# EAGLE design DP_pwer_controler_v1 (EAGLE 8.7.0)
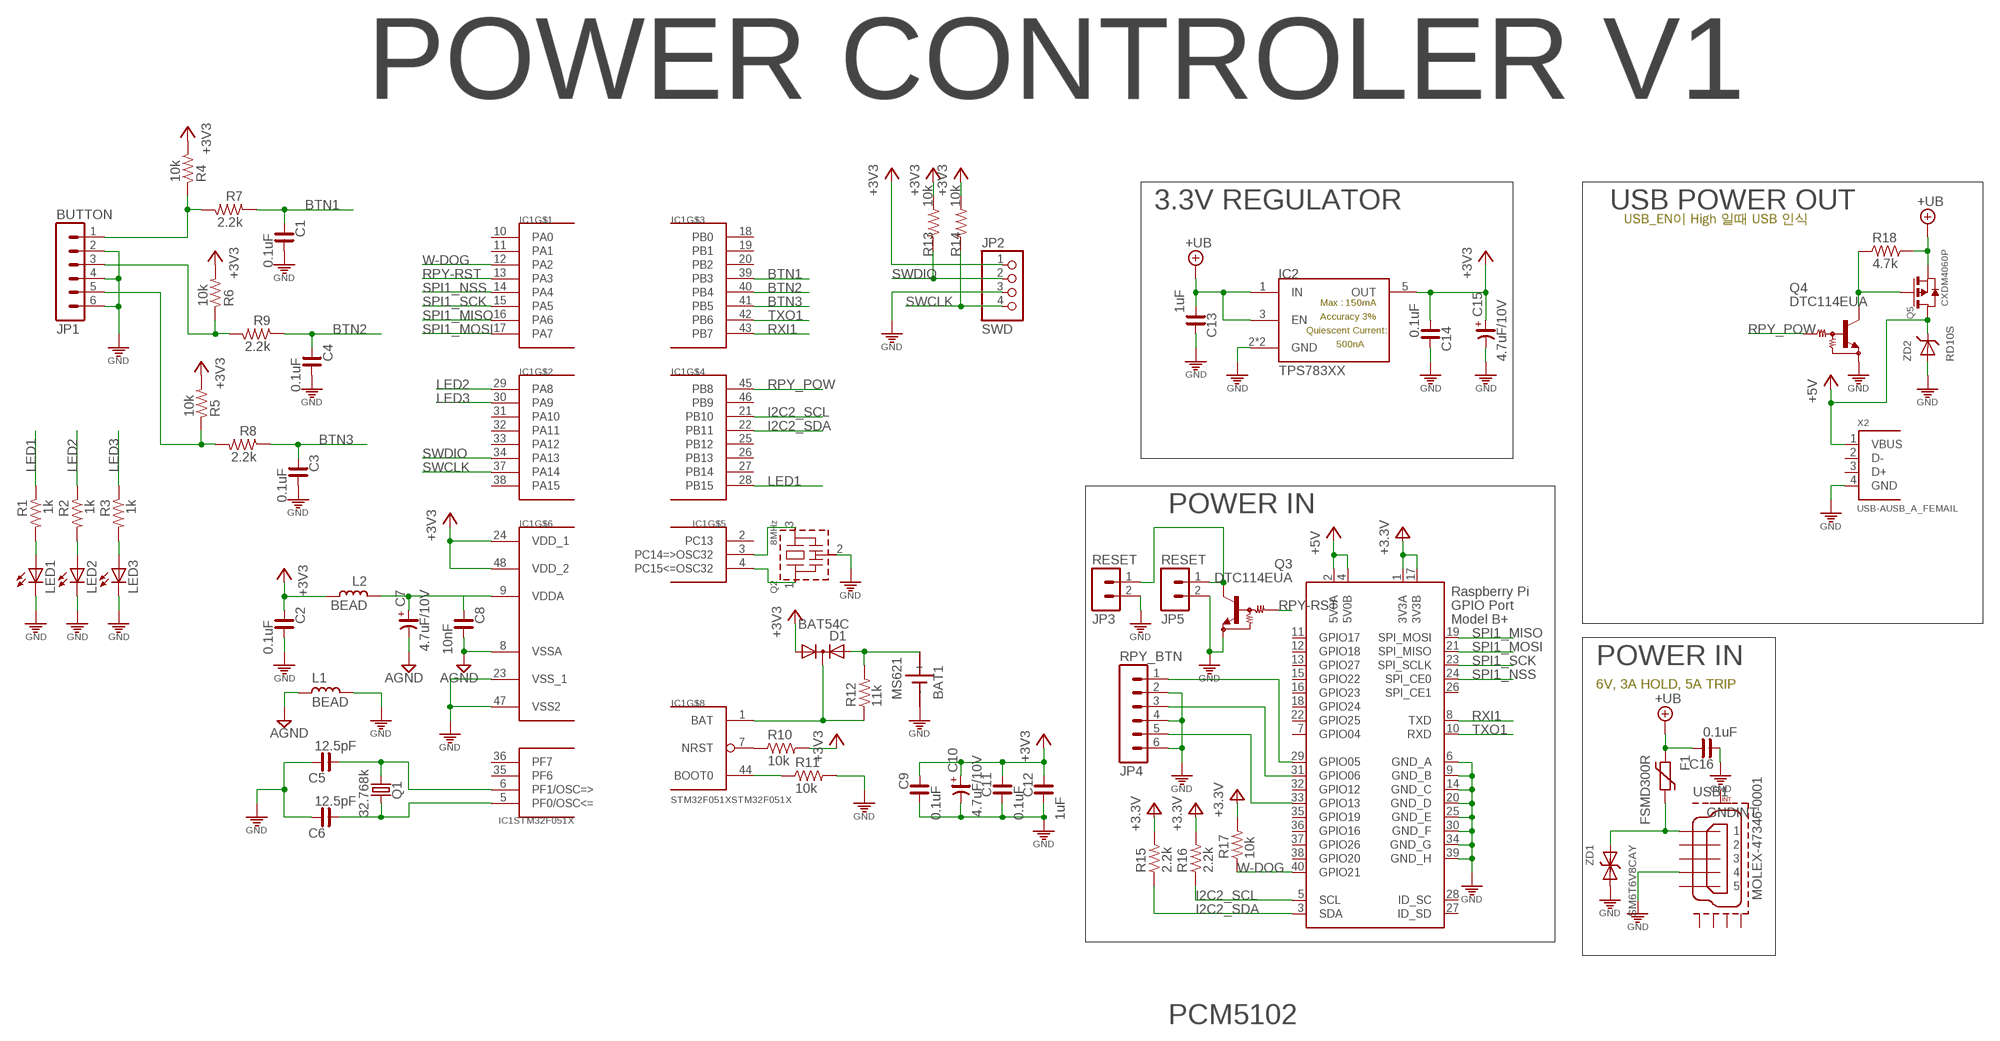
[diagram p0: schematic, sheet 1]

## Parts
BAT1  MS621  MS614  [MS621]
C1  0.1uF  C_0603  [C0603]
C2  0.1uF  C_0603  [C0603]
C3  0.1uF  C_0603  [C0603]
C4  0.1uF  C_0603  [C0603]
C5  12.5pF  C_0603  [C0603]
C6  12.5pF  C_0603  [C0603]
C7  4.7uF/10V  CP_2012  [C2012/T]
C8  10nF  C_0603  [C0603]
C9  0.1uF  C_0603  [C0603]
C10  4.7uF/10V  CP_2012  [C2012/T]
C11  0.1uF  C_0603  [C0603]
C12  1uF  C_0603  [C0603]
C13  1uF  C_0603  [C0603]
C14  0.1uF  C_0603  [C0603]
C15  4.7uF/10V  CP_2012  [C2012/T]
C16  0.1uF  C_0603  [C0603]
D1  BAT54C  [SOT23]
F1  FSMD300R  1812L  [1812L]
IC1  STM32F051XSTM32F051X  [TQFP48]
IC2  TPS783XX  [SOT23-5L]
JP1  BUTTON  MA06-1SMALL  [MA06-1-S]
JP2  SWD  PINHD-1X4M  [1X04M]
JP3  RESET  MA02SMD  [MA02-1-MOL]
JP4  RPY_BTN  MA06-1SMALL  [MA06-1-S]
JP5  RESET  MA02SMD  [MA02-1-MOL]
L1  BEAD  L_0603  [L0603]
L2  BEAD  L_0603  [L0603]
LED1  LEDSMD-1608  [LED-1608]
LED2  LEDSMD-1608  [LED-1608]
LED3  LEDSMD-1608  [LED-1608]
Q1  32.768k  MC-306  [MC-306]
Q2  8MHz  X-TAL-SMALLCSTCE16M00V53  [CSTLA_X]
Q3  DTC114EUA  [SC59-BEC]
Q4  DTC114EUA  [SC59-BEC]
Q5  CXDM4060P  CXDM4060PCXDM4060P  [SOT89]
R1  1k  R_0603  [R0603]
R2  1k  R_0603  [R0603]
R3  1k  R_0603  [R0603]
R4  10k  R_0603  [R0603]
R5  10k  R_0603  [R0603]
R6  10k  R_0603  [R0603]
R7  2.2k  R_0603  [R0603]
R8  2.2k  R_0603  [R0603]
R9  2.2k  R_0603  [R0603]
R10  10k  R_0603  [R0603]
R11  10k  R_0603  [R0603]
R12  11k  R_0603  [R0603]
R13  10k  R_0603  [R0603]
R14  10k  R_0603  [R0603]
R15  2.2k  R_0603  [R0603]
R16  2.2k  R_0603  [R0603]
R17  10k  R_0603  [R0603]
R18  4.7k  R_0603  [R0603]
USB1  MOLEX-47346-0001  [MOLEX-47364-0001]
X1  RASPI_BOARD_B+#_F  [RASPI_BOARD_B+_FULL]
X2  USB-AUSB_A_FEMAIL  [USB_A_FEMAIL]
ZD1  SM6T6V8CAY  ZDSM6T33CAY  [SMB]
ZD2  RD10S  ZENER_DIODERD47S  [DSMM]

## Nets
3V3: R15.2 R16.2 R17.2 X1.1(3V3A) X1.17(3V3B) ; supply symbol labelled +3V3
+3V3: C2.1 C9.1 C10.+ C11.1 C12.1 C14.2 C15.+ D1.G IC1.24(VDD_1) IC1.48(VDD_2) IC2.5(OUT) JP2.1 L2.1 R4.2 R5.2 R6.2 R10.2 R13.2 R14.2
+5V: Q5.2(D) Q5.2@1(D) X1.2(5V0A) X1.4(5V0B) X2.1(VBUS) ZD2.C
+UB: C13.2 C16.1 F1.P$1 IC2.1(IN) IC2.3(EN) Q5.1(S) R18.2
AGND: C7.- C8.2 IC1.8(VSSA) L1.2
BTN1: C1.1 IC1.39(PB3) R7.1
BTN2: C4.1 IC1.40(PB4) R9.1
BTN3: C3.1 IC1.41(PB5) R8.1
GND [GND]: BAT1.- C1.2 C2.2 C3.2 C4.2 C5.1 C6.1 C9.2 C10.- C11.2 C12.2 C13.1 C14.1 C15.- C16.2 IC1.23(VSS_1) IC1.47(VSS2) IC2.2(GND) IC2.4(GND) JP1.2 JP1.4 JP1.6 JP2.3 JP3.2 JP4.2 JP4.4 JP4.6 JP5.2 L1.1 LED1.C LED2.C LED3.C Q2.2(GND) Q3.1(GND) Q4.1(GND) R11.2 USB1.4 X1.6(GND_A) X1.9(GND_B) X1.14(GND_C) X1.20(GND_D) X1.25(GND_E) X1.30(GND_F) X1.34(GND_G) X1.39(GND_H) X2.4(GND) ZD1.C(K) ZD2.A
I2C2_SCL: IC1.21(PB10) R16.1 X1.5(SCL)
I2C2_SDA: IC1.22(PB11) R15.1 X1.3(SDA)
LED1: IC1.28(PB15) R1.1
LED2: IC1.29(PA8) R2.1
LED3: IC1.30(PA9) R3.1
N$1: JP1.5 R5.1 R8.2
N$2: F1.P$2 USB1.1 ZD1.A
N$3: IC1.7(NRST) R10.1
N$4: JP3.1 JP5.1 Q3.3(OUT)
N$7: JP4.1 X1.29(GPIO05)
N$8: C7.+ C8.1 IC1.9(VDDA) L2.2
N$9: BAT1.+ D1.S R12.2
N$11: JP1.3 R6.1 R9.2
N$12: JP4.3 X1.31(GPIO06)
N$13: IC1.3(PC14=>OSC32) Q2.3(OUT)
N$14: JP4.5 X1.33(GPIO13)
N$16: IC1.44(BOOT0) R11.1
N$17: LED1.A R1.2
N$18: LED2.A R2.2
N$19: LED3.A R3.2
N$20: JP1.1 R4.1 R7.2
N$32: Q4.3(OUT) Q5.3(G) R18.1
N$33: D1.D IC1.1(BAT) R12.1
N$38: IC1.4(PC15<=OSC32) Q2.1(IN)
N$95: C6.2 IC1.5(STM32F051X:PF0/OSC<=) Q1.1
N$96: C5.2 IC1.6(STM32F051X:PF1/OSC=>) Q1.4
RPY-RST: IC1.13(PA3) Q3.2(IN)
RPY_POW: IC1.45(PB8) Q4.2(IN)
RXI1: IC1.43(PB7) X1.8(TXD)
SPI1_MISO: IC1.16(PA6) X1.19(SPI_MOSI)
SPI1_MOSI: IC1.17(PA7) X1.21(SPI_MISO)
SPI1_NSS: IC1.14(PA4) X1.24(SPI_CE0)
SPI1_SCK: IC1.15(PA5) X1.23(SPI_SCLK)
SWCLK: IC1.37(PA14) JP2.4 R14.1
SWDIO: IC1.34(PA13) JP2.2 R13.1
TXO1: IC1.42(PB6) X1.10(RXD)
W-DOG: IC1.12(PA2) R17.1 X1.40(GPIO21)
Unconnected: IC1.2(PC13) IC1.10(PA0) IC1.11(PA1) IC1.18(PB0) IC1.19(PB1) IC1.20(PB2) IC1.25(PB12) IC1.26(PB13) IC1.27(PB14) IC1.31(PA10) IC1.32(PA11) IC1.33(PA12) IC1.35(STM32F051X:PF6) IC1.36(STM32F051X:PF7) IC1.38(PA15) IC1.46(PB9) USB1.2 USB1.3 USB1.5 USB1.GND1 USB1.GND2 USB1.GND3 USB1.GND4 X1.7(GPIO04) X1.11(GPIO17) X1.12(GPIO18) X1.13(GPIO27) X1.15(GPIO22) X1.16(GPIO23) X1.18(GPIO24) X1.22(GPIO25) X1.26(SPI_CE1) X1.27(ID_SD) X1.28(ID_SC) X1.32(GPIO12) X1.35(GPIO19) X1.36(GPIO16) X1.37(GPIO26) X1.38(GPIO20) X2.2(D-) X2.3(D+)

## Notes on the sheet
- https://webench.ti.com/webench5/power/webench5.cgi?app=filterarchitect&origin=ti_panel&filterType=Lowpass
- POWER CONTROLER V1
- 3.3V REGULATOR | USB POWER OUT
- USB_EN이 High 일때 USB 인식
- POWER IN
- POWER IN
- 6V, 3A HOLD, 5A TRIP
- PCM5102

## Library data of the parts
BAT1 = cona_lib:MS614: SII Micro Battery
C1-C6 C8 C9 C11-C14 C16 = cona_lib:C_: NON-POLARIZED CAP
C7 C10 C15 = cona_lib:CP_: POLARIZED CAP
D1 = cona_lib:BAT54C
F1 = ptc-littlefuse:1812L
IC1 = stm32:STM32F051X
IC2 = cona_lib:TPS783XX
JP1 JP4 = cona_lib:MA06-1: PIN HEADER
JP2 = pinhead:PINHD-1X4: PIN HEADER
JP3 JP5 = cona_lib:MA02
L1 L2 = cona_lib:L_: INDUCTOR
LED1-LED3 = cona_lib:LED: LED OSRAM: - CHIPLED LG R971, LG N971, LY N971, LG Q971, LY Q971, LO R971, LY R971 LH N974, LH R974 LS Q976, LO Q976, LY Q976 LO Q996 - Hyper CHIPLED LW Q18S LB Q993, LB Q99A, LB R99A - SideLED LS A670, LO A670, LY A670, LG A670, LP A670 LB A673, LV A673, LT A673, LW A673 LH A674 LY A675 LS A676, LA A676, LO A676, LY A676, LW A676 LS A679, LY A679, LG A679 - Hyper Micro SIDELED® LS Y876, LA Y876, LO Y876, LY Y876 LT Y87S - SmartLED LW L88C, LW L88S LB L89C, LB L89S, LG L890 LS L89K, LO L89K, LY L89K LS L896, LA L896, LO L896, LY L896 - TOPLED LS T670, LO T670, LY T670, LG T670, LP T670 LSG T670, LSP T670, LSY T670, LOP T670, LYG T670 LG T671, LOG T671, LSG T671 LB T673, LV T673, LT T673, LW T673 LH T674 LS T676, LA T676, LO T676, LY T676, LB T676, LH T676, LSB T676, LW T676 LB T67C, LV T67C, LT T67C, LS T67K, LO T67K, LY T67K, LW E67C LS E67B, LA E67B, LO E67B, LY E67B, LB E67C, LV E67C, LT E67C LW T67C LS T679, LY T679, LG T679 LS T770, LO T770, LY T770, LG T770, LP T770 LB T773, LV T773, LT T773, LW T773 LH T774 LS E675, LA E675, LY E675, LS T675 LS T776, LA T776, LO T776, LY T776, LB T776 LHGB T686 LT T68C, LB T68C - Hyper Mini TOPLED® LB M676 - Mini TOPLED Santana® LG M470 LS M47K, LO M47K, LY M47K Source: http://www.osram.convergy.de LUXEON: - LUMILED® LXK2-PW12-R00, LXK2-PW12-S00, LXK2-PW14-U00, LXK2-PW14-V00 LXK2-PM12-R00, LXK2-PM12-S00, LXK2-PM14-U00 LXK2-PE12-Q00, LXK2-PE12-R00, LXK2-PE12-S00, LXK2-PE14-T00, LXK2-PE14-U00 LXK2-PB12-K00, LXK2-PB12-L00, LXK2-PB12-M00, LXK2-PB14-N00, LXK2-PB14-P00, LXK2-PB14-Q00 LXK2-PR12-L00, LXK2-PR12-M00, LXK2-PR14-Q00, LXK2-PR14-R00 LXK2-PD12-Q00, LXK2-PD12-R00, LXK2-PD12-S00 LXK2-PH12-R00, LXK2-PH12-S00 LXK2-PL12-P00, LXK2-PL12-Q00, LXK2-PL12-R00 Source: www.luxeon.com KINGBRIGHT: KA-3528ASYC Source: www.kingbright.com
Q1 = crystal:MC-306: kHz RANGE CRYSTAL UNIT SMD Source: MC-306_405_406_E07X.PDF Homepage <http://www.epsontoyocom.co.jp>; MPN: MC-306 60.0KHZ 100PPM ,12.5PF; OC_FARNELL: 1278040; OC_NEWARK: 31M5576
Q2 = cona_lib:X-TAL-SMALL: Ceramic Resonators MuRata CSTCE08MOOG52A
Q3 Q4 = cona_lib:DTC114EUA: NPN Bias Resistor Transistor
Q5 = cona_lib:CXDM4060P
R1-R18 = cona_lib:R_: RESISTOR
USB1 = usb_con-update:MOLEX-47346-0001: MICRO USB B, BOTTOM MOUNT
X1 = raspberrypi_bastelstube_v13:RASPI_BOARD_B+#: Raspberry Pi GPIO connector with markings for the outer dimensions of the Raspberry Pi board model B+ with different sets of drill holes or mounting pads All pins connected
X2 = cona_lib:USB-A: USB A NTOM20014
ZD1 = GRU-EURO6:ZD
ZD2 = GRU-EURO6:ZENER_DIODE

## Net classes
0 default: clearance 0.152 mm
1 power: width 0.152 mm
2 GND: width 0.152 mm, clearance 0.152 mm

## Board
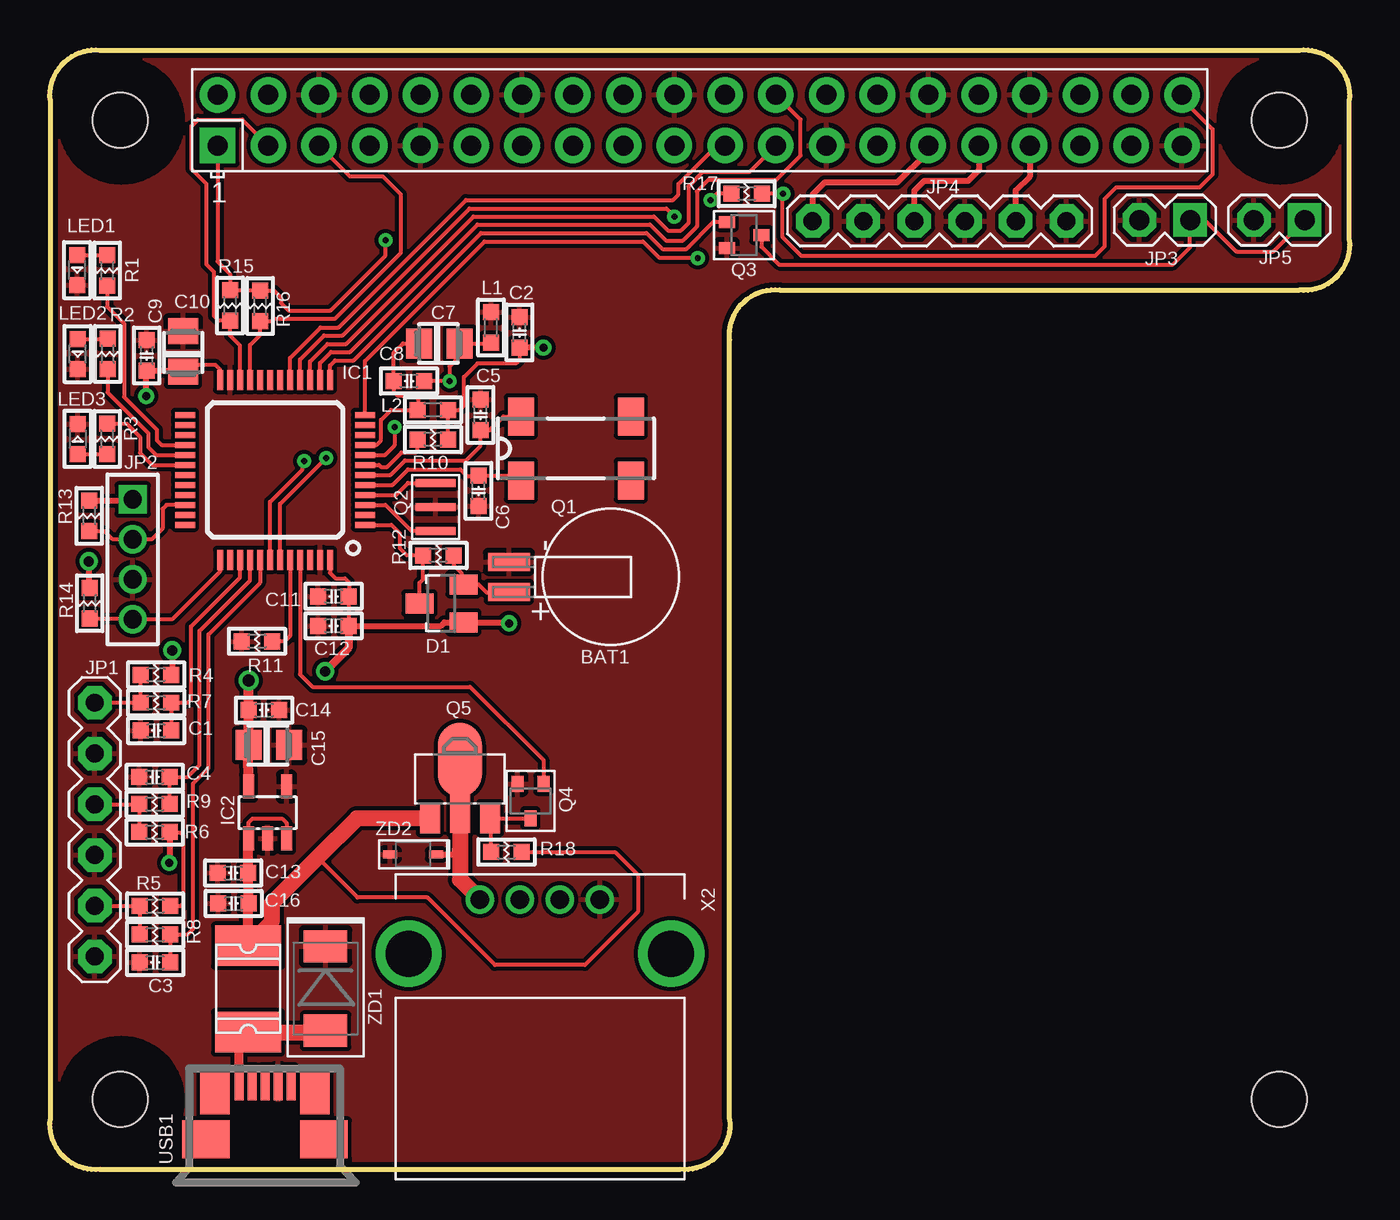
[diagram p1: board, top side]
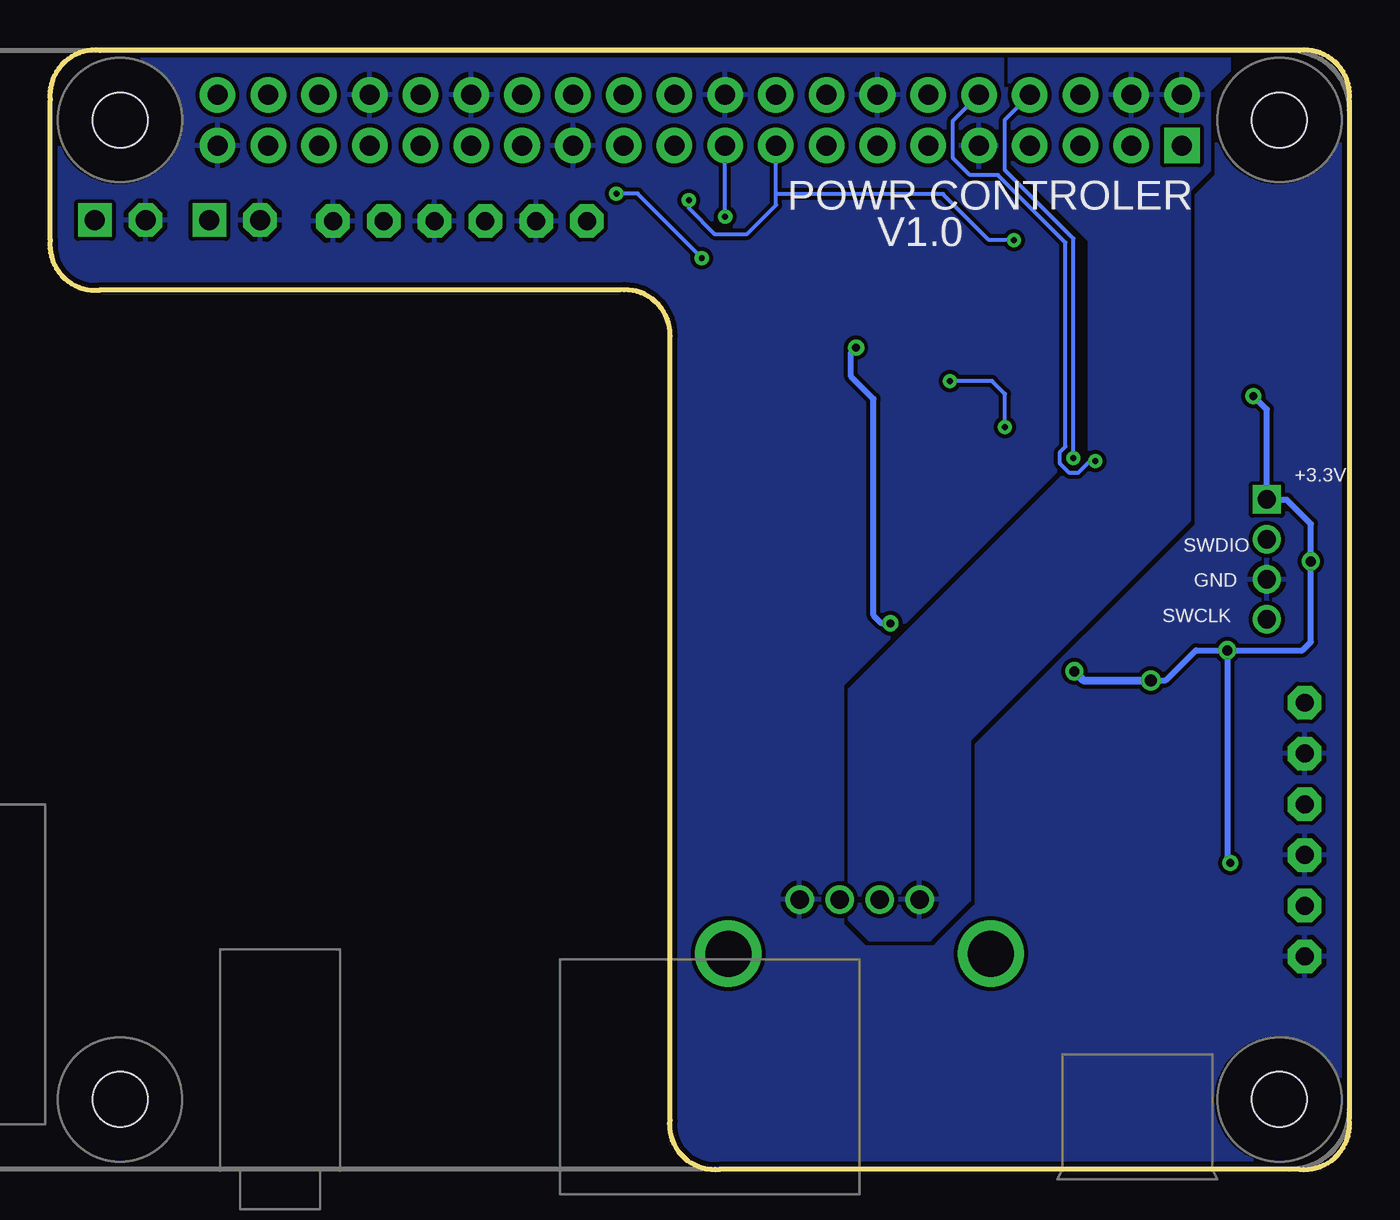
[diagram p2: board, bottom side, seen from below]

Size 65.03 x 56.03 mm. Coordinates in mm from the lower left corner, seen from the top.
Outline: 0.01,53.51 0.01,2.51 arc103 2.51,0.01 31.51,0.01 arc103 34.01,2.51 34.01,41.51 arc-103 36.51,44.01 62.51,44.01 arc103 65.01,46.51 65.01,53.51 arc103 62.51,56.01 2.51,56.01 arc103 0.01,53.51
Copper layers (1*16): Top 0.035mm / dielectric 1.5mm / Bottom 0.035mm
Design rules "KHC_mm": minimum track width 0.2mm, minimum drill 0.3mm, track to track 0.2mm, track to pad 0.2mm, pad to pad 0.2mm, via to via 0.2mm, smd to smd 0.2mm, copper to edge 10mil, drill to drill 0.2mm, minimum pad ring 10mil, minimum via ring 8mil, stop-mask expansion 4mil, vias tented up to drill 0mil, thermal gap 10mil

### Footprints (pad centres in the part's own frame; a part is rotated, then mirrored left to right if it is on the bottom)
MS621 = smd 2.1 x 0.9: + 5.1,0.75; - 5.1,-0.75
C0603 = smd 0.8 x 0.8: 1 -0.762,0; 2 0.762,0
C2012/T = smd 1.3 x 1.5: + 1.016,0; - -1.016,0
SOT23 = smd 1 x 1.4: D 0,-1.1; G 0.95,1.1; S -0.95,1.1
1812L = smd 2.03 x 3.3: P$1 -2.16,0; P$2 2.16,0
TQFP48 = smd 0.3 x 1: 1 -2.75,-4.5; 2 -2.25,-4.5; 3 -1.75,-4.5; 4 -1.25,-4.5; 5 -0.75,-4.5; 6 -0.25,-4.5; 7 0.25,-4.5; 8 0.75,-4.5; 9 1.25,-4.5; 10 1.75,-4.5; 11 2.25,-4.5; 12 2.75,-4.5; 25 2.75,4.5; 26 2.25,4.5; 27 1.75,4.5; 28 1.25,4.5; 29 0.75,4.5; 30 0.25,4.5; 31 -0.25,4.5; 32 -0.75,4.5; 33 -1.25,4.5; 34 -1.75,4.5; 35 -2.25,4.5; 36 -2.75,4.5 | smd 1 x 0.3: 13 4.5,-2.75; 14 4.5,-2.25; 15 4.5,-1.75; 16 4.5,-1.25; 17 4.5,-0.75; 18 4.5,-0.25; 19 4.5,0.25; 20 4.5,0.75; 21 4.5,1.25; 22 4.5,1.75; 23 4.5,2.25; 24 4.5,2.75; 37 -4.5,2.75; 38 -4.5,2.25; 39 -4.5,1.75; 40 -4.5,1.25; 41 -4.5,0.75; 42 -4.5,0.25; 43 -4.5,-0.25; 44 -4.5,-0.75; 45 -4.5,-1.25; 46 -4.5,-1.75; 47 -4.5,-2.25; 48 -4.5,-2.75
SOT23-5L = smd 0.55 x 1.2: 1 -0.95,-1.3; 2 0,-1.3; 3 0.95,-1.3; 4 0.95,1.3; 5 -0.95,1.3
MA06-1-S = drill 0.9 pad 1.676 octagon: 1 -6.35,-1.27; 2 -3.81,-1.27; 3 -1.27,-1.27; 4 1.27,-1.27; 5 3.81,-1.27; 6 6.35,-1.27
1X04M = drill 0.914 square: 1 -3,0 | drill 0.914: 2 -1,0; 3 1,0; 4 3,0
MA02-1-MOL = drill 1 pad 1.676 square: 1 -1.27,0 | drill 1 pad 1.676 octagon: 2 1.27,0
L0603 = smd 0.8 x 0.8: 1 -0.762,0; 2 0.762,0
LED-1608 = smd 0.8 x 0.8: A -0.75,0; C 0.75,0
MC-306 = smd 1.3 x 1.9: 1 -2.75,-1.6; 2 2.75,-1.6; 3 2.75,1.6; 4 -2.75,1.6
CSTLA_X = smd 0.4 x 2: 1 -1.2,0; 2 0,0; 3 1.2,0
SC59-BEC = smd 0.6 x 0.8: 1 0.65,-0.863; 2 -0.65,-0.863; 3 0,0.863
SOT89 = smd 1 x 1.5: 1 -1.499,-1.981; 3 1.499,-1.981 | smd 1 x 2: 2 0,-1.727 | smd 2.2 x 3.7: 2@1 0,0.94
R0603 = smd 0.8 x 0.8: 1 -0.762,0; 2 0.762,0
MOLEX-47364-0001 = smd 1.7 x 0.45: 1 2.8,1.3; 2 2.8,0.65; 3 2.8,0; 4 2.8,-0.65; 5 2.8,-1.3 | smd 1.9 x 2.375: GND1 0,2.95; GND4 0,-2.95 | smd 2.1 x 1.475: GND2 2.3,2.5; GND3 2.3,-2.5
RASPI_BOARD_B+_FULL = drill 1 pad 1.778 square: 1 8.37,51.23 | drill 1 pad 1.778: 2 8.37,53.77; 3 10.91,51.23; 4 10.91,53.77; 5 13.45,51.23; 6 13.45,53.77; 7 15.99,51.23; 8 15.99,53.77; 9 18.53,51.23; 10 18.53,53.77; 11 21.07,51.23; 12 21.07,53.77; 13 23.61,51.23; 14 23.61,53.77; 15 26.15,51.23; 16 26.15,53.77; 17 28.69,51.23; 18 28.69,53.77; 19 31.23,51.23; 20 31.23,53.77; 21 33.77,51.23; 22 33.77,53.77; 23 36.31,51.23; 24 36.31,53.77; 25 38.85,51.23; 26 38.85,53.77; 27 41.39,51.23; 28 41.39,53.77; 29 43.93,51.23; 30 43.93,53.77; 31 46.47,51.23; 32 46.47,53.77; 33 49.01,51.23; 34 49.01,53.77; 35 51.55,51.23; 36 51.55,53.77; 37 54.09,51.23; 38 54.09,53.77; 39 56.63,51.23; 40 56.63,53.77 | hole 2.75: 3.5,3.5; 3.5,52.5; 61.5,3.5; 61.5,52.5
USB_A_FEMAIL = drill 0.92: 1 3,0; 2 1,0; 3 -1,0; 4 -3,0 | drill 2.3: SHILD -6.57,2.71; SHILD@2 6.57,2.71
SMB = smd 1.62 x 2.18: A 2.11,0; C -2.11,0
DSMM = smd 0.7 x 0.4: A 1.15,0; C -1.15,0

### Placement (x,y rotation side)
BAT1  28.06,29.66 180 top
C1  5.31,21.96 180 top
C2  23.49,41.89 90 top
C3  5.26,10.36 180 top
C4  5.24,19.64 180 top
C5  21.54,37.76 270 top
C6  21.44,33.96 90 top
C7  19.49,41.34 180 top
C8  17.96,39.46 0 top
C9  4.84,40.74 90 top
C10  6.66,40.94 270 top
C11  14.19,28.69 180 top
C12  14.19,27.21 180 top
C13  9.16,14.84 0 top
C14  10.71,22.99 180 top
C15  10.96,21.24 180 top
C16  9.19,13.31 180 top
D1  19.59,28.34 270 top
F1  9.91,9.04 270 top
IC1  11.26,35.01 90 top
IC2  10.89,17.86 0 top
JP1  3.51,17.01 270 top
JP2  4.14,30.54 270 top
JP3  55.79,47.51 180 top
JP4  44.51,48.74 0 top
JP5  61.51,47.51 180 top
L1  22.06,42.14 270 top
L2  19.16,38.01 180 top
LED1  1.36,45.01 270 top
LED2  1.39,40.81 270 top
LED3  1.39,36.56 90 top
Q1  26.31,36.09 0 top
Q2  19.29,33.16 270 top
Q3  34.74,46.76 270 top
Q4  24.04,18.44 180 top
Q5  20.51,19.56 0 top
R1  2.86,44.99 90 top
R2  2.89,40.81 90 top
R3  2.86,36.56 270 top
R4  5.31,24.76 0 top
R5  5.26,13.19 0 top
R6  5.24,16.89 0 top
R7  5.31,23.36 180 top
R8  5.26,11.76 180 top
R9  5.24,18.29 180 top
R10  19.16,36.54 0 top
R11  10.36,26.44 180 top
R12  19.44,30.74 0 top
R13  1.96,32.71 90 top
R14  1.99,28.34 90 top
R15  9.01,43.24 90 top
R16  10.51,43.21 90 top
R17  34.86,48.84 180 top
R18  22.84,15.89 0 top
USB1  10.76,1.51 90 top
X1  0.01,0.01 0 top
X2  24.51,13.51 180 top
ZD1  13.79,9.06 270 top
ZD2  18.16,15.76 180 top

### Tracks (layer width: path | path; a pad name or v marks a point on that pad's centre or on a via)
3V3  (via drill 0.3)
  Top 0.2: X1.1 8.38,45.44 9.01,44.81 R15.2 10.49,44 R16.2 11.23,43.98 11.56,43.64 11.56,43.36 11.94,42.99 14.04,42.99 16.79,45.74 v16.79,46.51 | R17.2 33.39,48.84 v33.06,48.51
  Bottom 0.2: v33.06,48.51 33.06,48.11 31.76,46.81 30.14,46.81 28.69,48.26 28.69,48.76 | 28.69,48.76 28.69,51.23 X1.17 | v16.79,46.51 18.04,46.51 20.34,48.81 28.64,48.81 28.69,48.76
+3V3  (via drill 0.4, 0.5, 0.6)
  Top 0.2: R5.2 6.54,13.19 6.69,13.34 6.69,16.71 6.56,16.84 6.05,16.84 R6.2 | R10.2 L2.1 20.49,38.01 20.71,38.24 20.71,39.66 21.39,40.34 23.31,40.34 23.49,40.51 C2.1 | IC1.48 14.01,29.86 14.29,29.59 14.76,29.59 14.96,29.39 C11.1 C12.1 | IC1.24 8.51,40.04 8.29,40.26 7,40.26 C10.+
  Top 0.3: v6.11,25.99 6.11,24.8 R4.2 | v1.94,30.44 1.94,29.15 R14.2 | R13.2 4.08,33.48 JP2.1 | R6.2 5.99,16.88 5.99,15.36 v5.96,15.34 | v4.81,38.71 4.81,39.95 C9.1 6.61,39.98 C10.+ | 14.94,27.2 C12.1 19.56,27.21 19.74,27.39 D1.G 22.91,27.39 v22.96,27.34 | v24.69,41.14 23.58,41.14 C2.1
  Top 0.4: 14.94,27.2 14.94,26.11 v13.76,24.94
  Top 0.5: IC2.5 9.91,21 C15.+ 9.95,22.88 C14.2 v9.95,24.48
  Bottom 0.3: v6.11,25.99 7.69,25.99 9.2,24.48 v9.95,24.48 | v6.11,25.99 2.36,25.99 1.94,26.41 v1.94,30.44 1.94,32.31 3.14,33.51 4.11,33.51 JP2.1 4.14,38.04 v4.81,38.71 | v6.11,25.99 6.11,15.46 v5.96,15.34 | v22.96,27.34 23.41,27.34 23.81,27.74 23.81,38.56 24.94,39.69 24.94,40.89 v24.69,41.14
  Bottom 0.4: v13.76,24.94 13.31,24.49 9.96,24.49 v9.95,24.48
+5V
  Top 0.3: ZD2.C 20.26,15.76 20.51,16.01 | Q5.2 Q5.2@1
  Top 0.8: Q5.2 20.51,16.01 20.51,14.51 X2.1
  pour Bottom: 6.01,56.01 17.01,56.01 17.01,50.51 13.01,46.51 13.01,36.01 25.01,24.01 25.01,12.51 24.01,11.51 21.01,11.51 19.01,13.51 19.01,21.51 8.01,32.51 8.01,49.01 7.01,50.01 7.01,54.01 6.01,55.01
+UB
  Top 0.2: R18.2 28.26,15.89 29.41,14.74 29.41,12.89 26.76,10.24 22.26,10.24 18.89,13.61 15.39,13.61 13.46,15.54 13.46,15.56 13.4,15.63 | IC2.1 9.94,17.36 10.14,17.56 11.61,17.56 11.84,17.34 IC2.3
  Top 0.5: F1.P$1 9.91,13.38 C16.1 C13.2 9.93,16.3 IC2.1
  Top 0.8: Q5.1 15.36,17.58 13.4,15.63 11.09,13.31 11.09,12.37 F1.P$1
AGND  (via drill 0.3)
  Top 0.2: L1.2 21.88,41.34 C7.- 20.5,40.7 19.99,40.19 v19.99,39.46 C8.2 | IC1.8 16.76,35.76 17.24,36.24 v17.24,37.16
  Bottom 0.2: v19.99,39.46 17.89,39.46 17.24,38.81 v17.24,37.16
BTN1
  Top 0.2: IC1.39 9.51,29.64 7.06,27.19 7.06,23.54 6.89,23.36 R7.1 C1.1
BTN2
  Top 0.2: R9.1 C4.1 6.89,19.64 7.49,20.24 7.49,26.96 10.01,29.49 IC1.40
BTN3
  Top 0.2: C3.1 R8.1 6.89,11.76 7.16,12.04 7.16,19.31 7.94,20.09 7.94,26.79 10.51,29.36 IC1.41
GND
  pour Top (rank 4): 0.01,0.01 0.01,56.01 76.01,56.01 76.01,0.01
  pour Bottom (rank 4): 0.01,0.01 0.01,56.01 76.01,56.01 76.01,0.01
I2C2_SCL
  Top 0.2: IC1.21 10.01,41.26 10.51,41.76 R16.1 10.53,42.44 11.09,42.44 11.21,42.56 14.24,42.56 17.56,45.89 17.56,48.79 16.66,49.69 15.02,49.69 X1.5
I2C2_SDA
  Top 0.2: IC1.22 9.51,41.24 9.01,41.74 R15.1 8.45,42.48 8.21,42.71 8.21,44.91 7.84,45.29 7.84,49.31 7.09,50.06 7.09,52.21 7.41,52.54 9.63,52.54 X1.3
LED1
  Top 0.2: IC1.28 5.59,36.26 5.36,36.49 5.36,37.01 3.71,38.66 3.71,42.34 2.86,43.19 R1.1
LED2
  Top 0.2: IC1.29 5.31,35.76 4.94,36.14 4.94,36.84 2.89,38.89 R2.1
LED3
  Top 0.2: IC1.30 5.11,35.26 4.51,35.86 4.51,36.66 3.85,37.33 R3.1
N$1
  Top 0.2: JP1.5 4.49,13.2 R5.1 R8.2
N$2
  Top 0.45: USB1.1 9.46,6.43 F1.P$2
  Top 0.8: F1.P$2 13.71,6.88 ZD1.A
N$3
  Top 0.2: IC1.7 16.46,35.26 16.56,35.16 16.86,35.16 17.59,35.89 18.31,35.89 18.39,35.96 18.39,36.53 R10.1
N$4
  Top 0.2: JP5.1 61.21,45.94 59.36,45.94 57.79,47.51 JP3.1 57.04,47.49 57.04,46.14 56.19,45.29 36.49,45.29 35.6,46.18 Q3.3
N$5
  cutout Top: 3.56,6.49 arc90 0.56,3.49 arc90 3.56,0.49 arc90 6.56,3.49 arc90
  cutout Bottom: 3.56,6.49 arc90 0.56,3.49 arc90 3.56,0.49 arc90 6.56,3.49 arc90
N$6
  cutout Top: 3.56,55.49 arc90 0.56,52.49 arc90 3.56,49.49 arc90 6.56,52.49 arc90
  cutout Bottom: 3.56,55.49 arc90 0.56,52.49 arc90 3.56,49.49 arc90 6.56,52.49 arc90
N$7
  Top 0.3: X1.29 43.94,50.94 42.39,49.39 38.76,49.39 38.16,48.79 JP4.1
N$8
  Top 0.2: IC1.9 16.34,36.26 16.56,36.49 16.56,37.51 17.06,38.01 L2.2 18.41,38.03 18.41,38.56 18.24,38.74 17.39,38.74 17.2,38.93 C8.1 17.2,40.88 17.66,41.34 C7.+
N$9
  Top 0.2: R12.2 20.2,30.25 20.59,29.86 20.59,29.39 D1.S 21.44,29.29 21.84,28.89 23.34,28.89 23.49,29.04 23.09,29.04 BAT1.+
N$10
  cutout Top: 61.56,55.49 arc90 58.56,52.49 arc90 61.56,49.49 arc90 64.56,52.49 arc90
  cutout Bottom: 61.56,55.49 arc90 58.56,52.49 arc90 61.56,49.49 arc90 64.56,52.49 arc90
  cutout Bottom: 61.56,6.49 arc90 58.56,3.49 arc90 61.56,0.49 arc90 64.56,3.49 arc90
  cutout Top: 61.56,6.49 arc90 58.56,3.49 arc90 61.56,0.49 arc90 64.56,3.49 arc90
N$11
  Top 0.2: JP1.3 R9.2 R6.1
N$12
  Top 0.3: X1.31 46.48,50.01 45.94,49.46 43.74,49.46 43.24,48.96 JP4.3
N$13
  Top 0.2: IC1.3 16.79,33.26 18.09,31.96 Q2.3
N$14
  Top 0.3: X1.33 49.02,49.7 48.31,48.99 48.31,47.48 JP4.5
N$16
  Top 0.2: IC1.44 12.01,26.71 11.74,26.44 R11.1
N$17
  Top 0.2: LED1.A 2.85,45.76 R1.2
N$18
  Top 0.2: LED2.A 2.88,41.56 R2.2
N$19
  Top 0.2: LED3.A 2.85,35.81 R3.2
N$20
  Top 0.2: JP1.1 R7.2 R4.1
N$32
  Top 0.2: R18.1 22.08,17.52 Q5.3 Q4.3
N$33
  Top 0.2: IC1.1 17.09,32.26 17.51,31.84 17.51,31.09 17.86,30.74 R12.1 18.66,30.73 18.66,29.54 18.49,29.36 D1.D
N$38
  Top 0.2: IC1.4 17.31,33.76 17.91,34.36 Q2.1
N$95
  Top 0.2: IC1.5 17.14,34.26 17.91,35.04 20.54,35.04 20.86,34.71 21.43,34.71 C6.2 23.33,34.73 Q1.1
N$96
  Top 0.2: IC1.6 17.04,34.76 17.76,35.49 20.81,35.49 21.54,36.21 C5.2 22,37 22.69,37.69 Q1.4
RPY-RST
  Top 0.2: IC1.13 14.01,40.24 14.26,40.49 15.19,40.49 21.56,46.86 29.84,46.86 30.64,46.06 31.84,46.06 33.19,47.41 Q3.2
RPY_POW
  Top 0.2: Q4.2 24.69,20.49 21.01,24.16 13.14,24.16 12.51,24.79 IC1.45
RXI1  (via drill 0.3)
  Top 0.2: IC1.43 11.51,33.31 v13.81,35.61
  Bottom 0.2: v13.81,35.61 13.81,46.59 17.24,50.01 17.24,52.55 X1.8
SPI1_MISO  (via drill 0.3)
  Top 0.2: IC1.16 12.51,40.54 13.71,41.74 14.64,41.74 20.99,48.09 30.84,48.09 v31.24,47.69
  Bottom 0.2: v31.24,47.69 X1.19
SPI1_MOSI
  Top 0.2: IC1.17 12.01,40.61 13.54,42.14 14.44,42.14 20.81,48.51 31.16,48.51 31.44,48.79 31.44,49.31 33.37,51.24 X1.21
SPI1_NSS
  Top 0.2: IC1.14 13.51,40.36 14.06,40.91 15.01,40.91 21.39,47.29 30.01,47.29 30.81,46.49 31.66,46.49 32.36,47.19 32.36,48.94 32.96,49.54 36.36,49.54 37.56,50.74 37.56,52.54 X1.24
SPI1_SCK
  Top 0.2: IC1.15 13.01,40.44 13.89,41.31 14.81,41.31 21.19,47.69 30.21,47.69 30.91,46.99 31.56,46.99 31.94,47.36 31.94,49.19 32.69,49.94 35.02,49.94 X1.23
SWCLK
  Top 0.2: R14.1 4.1,27.58 JP2.4 6.11,27.54 8.51,29.94 IC1.37
SWDIO
  Top 0.2: IC1.34 5.84,33.26 5.64,33.06 5.64,32.09 5.09,31.54 JP2.2 4.11,31.56 3.11,31.56 2.73,31.95 R13.1
TXO1  (via drill 0.3)
  Top 0.2: IC1.42 11.01,33.41 12.64,35.04 12.64,35.34 v12.71,35.46
  Bottom 0.2: X1.10 19.84,52.49 19.84,50.61 18.99,49.76 17.59,49.76 14.21,46.39 14.21,36.19 14.49,35.91 14.49,35.34 14.01,34.86 13.59,34.86 13.04,35.41 12.76,35.41 v12.71,35.46
W-DOG  (via drill 0.3)
  Top 0.2: IC1.12 15.76,40.46 21.74,46.44 29.66,46.44 30.46,45.64 32.26,45.64 v32.41,45.61 | R17.1 v36.69,48.84 36.66,48.81 36.66,46.66 37.61,45.71 52.29,45.71 52.76,46.19 52.76,48.56 53.34,49.14 57.51,49.14 58.16,49.79 58.16,52.06 56.64,53.58 X1.40
  Bottom 0.2: v32.41,45.61 32.38,45.59 R17.1 v36.69,48.84

### Text on the board
_bplace: POWR CONTROLER | V1.0 | +3.3V | SWDIO | GND | SWCLK